# EAGLE schematic royer_1kw (EAGLE 7.6.0)
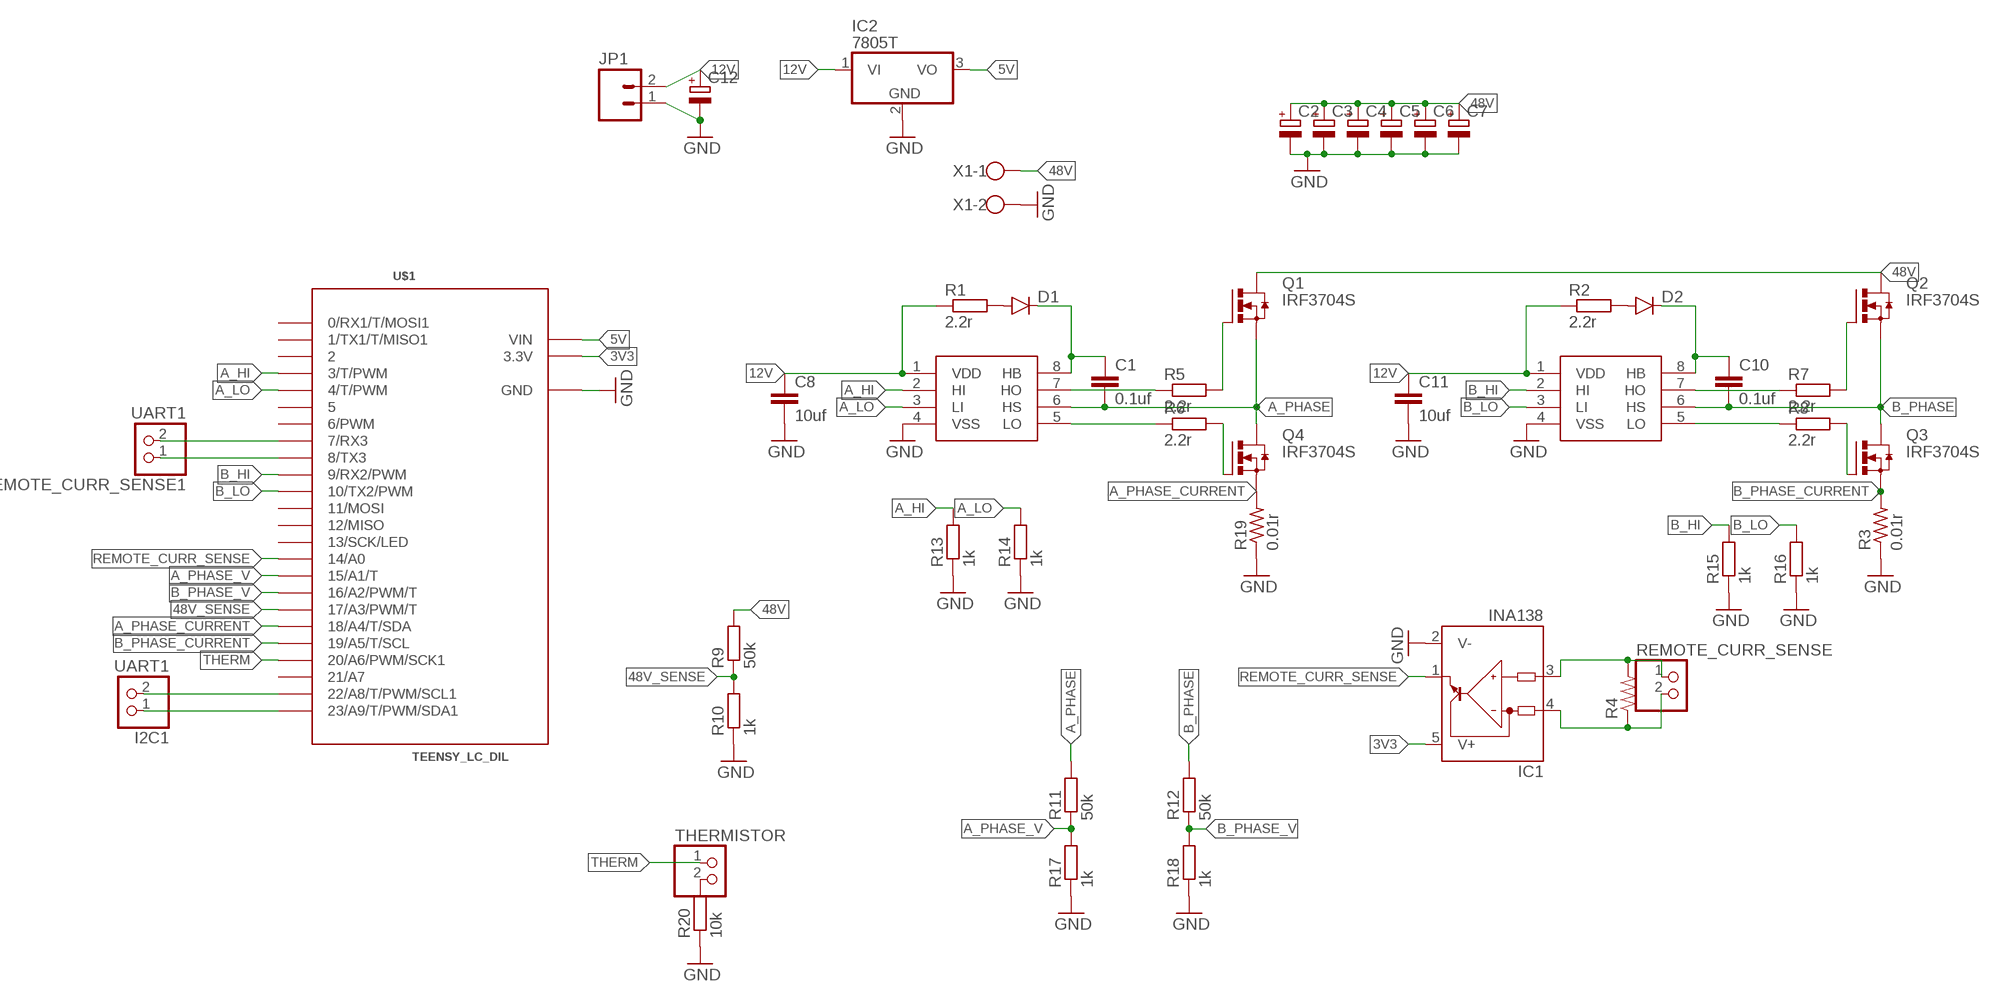
[diagram p0: schematic, sheet 1]

## Parts
C1  0.1uf  C-EUC0603  [C0603]
C2  CPOL-EUE7.5-16  [E7,5-16]
C3  CPOL-EUE7.5-16  [E7,5-16]
C4  CPOL-EUE7.5-16  [E7,5-16]
C5  CPOL-EUE7.5-16  [E7,5-16]
C6  CPOL-EUE7.5-16  [E7,5-16]
C7  CPOL-EUE7.5-16  [E7,5-16]
C8  10uf  C-EUC0805  [C0805]
C10  0.1uf  C-EUC0603  [C0603]
C11  10uf  C-EUC0805  [C0805]
C12  CPOL-EUE2.5-7  [E2,5-7]
D1  DIODESMA  [SMA-DIODE]
D2  DIODESMA  [SMA-DIODE]
I2C1  UART1  PINHD-1X2  [1X02]
IC1  INA138  [SOT23-5]
IC2  7805T  [TO220H]
JP1  M023.5MM  [SCREWTERMINAL-3.5MM-2]
Q1  IRF3704S  [D2PACK]
Q2  IRF3704S  [D2PACK]
Q3  IRF3704S  [D2PACK]
Q4  IRF3704S  [D2PACK]
R1  2.2r  R-EU_R1210  [R1210]
R2  2.2r  R-EU_R1210  [R1210]
R3  0.01r  R-US_R3225  [R3225]
R4  RESISTOR1206  [1206]
R5  2.2r  R-EU_R1210  [R1210]
R6  2.2r  R-EU_R1210  [R1210]
R7  2.2r  R-EU_R1210  [R1210]
R8  2.2r  R-EU_R1210  [R1210]
R9  50k  R-EU_R0603  [R0603]
R10  1k  R-EU_R0603  [R0603]
R11  50k  R-EU_R0603  [R0603]
R12  50k  R-EU_R0603  [R0603]
R13  1k  R-EU_R0603  [R0603]
R14  1k  R-EU_R0603  [R0603]
R15  1k  R-EU_R0603  [R0603]
R16  1k  R-EU_R0603  [R0603]
R17  1k  R-EU_R0603  [R0603]
R18  1k  R-EU_R0603  [R0603]
R19  0.01r  R-US_R3225  [R3225]
R20  10k  R-EU_R0603  [R0603]
REMOTE_CURR_SENSE  PINHD-1X2  [1X02]
REMOTE_CURR_SENSE1  UART1  PINHD-1X2  [1X02]
THERMISTOR  PINHD-1X2  [1X02]
U$1  TEENSY_LC_DIL  [TEENSY_3.0-3.2&LC_DIL]
U$2  LM5109  [SOIC8]
U$4  LM5109  [SOIC8]
X1  W237-102  [W237-102]

## Nets
3V3: IC1.5(V+) U$1.3.3V
5V: IC2.3(VO) U$1.VIN
12V: C8.1 C11.1 C12.+ IC2.1(VI) JP1.2 R1.1 R2.1 U$2.1(VDD) U$4.1(VDD)
48V: C2.+ C3.+ C4.+ C5.+ C6.+ C7.+ Q1.2(D) Q2.2(D) R9.2 X1.1
48V_SENSE: R9.1 R10.2 U$1.17/A3(17/A3/PWM/T)
A_HI: R13.2 U$1.3(3/T/PWM) U$2.2(HI)
A_LO: R14.2 U$1.4(4/T/PWM) U$2.3(LI)
A_PHASE: C1.2 Q1.3(S) Q4.2(D) R11.2 U$2.6(HS)
A_PHASE_CURRENT: Q4.3(S) R19.2 U$1.18/A4(18/A4/T/SDA)
A_PHASE_V: R11.1 R17.2 U$1.15/A1(15/A1/T)
B_HI: R15.2 U$1.9(9/RX2/PWM) U$4.2(HI)
B_LO: R16.2 U$1.10(10/TX2/PWM) U$4.3(LI)
B_PHASE: C10.2 Q2.3(S) Q3.2(D) R12.2 U$4.6(HS)
B_PHASE_CURRENT: Q3.3(S) R3.2 U$1.19/A5(19/A5/T/SCL)
B_PHASE_V: R12.1 R18.2 U$1.16/A2(16/A2/PWM/T)
GND: C2.- C3.- C4.- C5.- C6.- C7.- C8.2 C11.2 C12.- IC1.2(V-) IC2.2(GND) JP1.1 R3.1 R10.1 R13.1 R14.1 R15.1 R16.1 R17.1 R18.1 R19.1 R20.1 U$1.AGND(GND) U$1.GND U$2.4(VSS) U$4.4(VSS) X1.2
N$1: R7.1 U$4.7(HO)
N$2: R8.1 U$4.5(LO)
N$3: Q1.1(G) R5.2
N$4: Q4.1(G) R6.2
N$5: D1.A R1.2
N$6: C1.1 D1.C U$2.8(HB)
N$7: IC1.3(IN+) R4.2 REMOTE_CURR_SENSE.1
N$8: Q2.1(G) R7.2
N$9: Q3.1(G) R8.2
N$10: D2.A R2.2
N$11: C10.1 D2.C U$4.8(HB)
N$12: IC1.4(IN-) R4.1 REMOTE_CURR_SENSE.2
N$13: R20.2 THERMISTOR.2
N$15: R5.1 U$2.7(HO)
N$16: R6.1 U$2.5(LO)
N$17: REMOTE_CURR_SENSE1.1 U$1.8(8/TX3)
N$18: REMOTE_CURR_SENSE1.2 U$1.7(7/RX3)
N$19: I2C1.1 U$1.23/A9(23/A9/T/PWM/SDA1)
N$20: I2C1.2 U$1.22/A8(22/A8/T/PWM/SCL1)
REMOTE_CURR_SENSE: IC1.1(OUT) U$1.14/A0
THERM: THERMISTOR.1 U$1.20/A6(20/A6/PWM/SCK1)
Unconnected: U$1.0(0/RX1/T/MOSI1) U$1.1(1/TX1/T/MISO1) U$1.2 U$1.5 U$1.6(6/PWM) U$1.11(11/MOSI) U$1.12(12/MISO) U$1.13(13/SCK/LED) U$1.21/A7

## Library data of the parts
C1 C8 C10 C11 = rcl:C-EU: CAPACITOR, European symbol
C2-C7 C12 = rcl:CPOL-EU: POLARIZED CAPACITOR, European symbol
D1 D2 = SparkFun-DiscreteSemi:DIODE: Diode These are standard reverse protection diodes and small signal diodes. SMA package can handle up to about 1A. SOD-323 can handle about 200mA. What the SOD-323 package when ordering, there are some mfgs out there that are 5-pin packages.
I2C1 REMOTE_CURR_SENSE REMOTE_CURR_SENSE1 THERMISTOR = pinhead:PINHD-1X2: PIN HEADER
IC1 = burr-brown:INA138: High-Side Measurement Current Shunt Monitor; MF: TEXAS INSTRUMENTS; MPN: INA138NA/250; OC_FARNELL: 1564888; OC_NEWARK: 80K5906
IC2 = linear:78*: Positive VOLTAGE REGULATOR Source: http://cache.national.com/ds/LM/LM78L05.pdf http://www.fairchildsemi.com/ds/LM/LM7805.pdf
JP1 = SparkFun-Connectors:M02: Standard 2-pin 0.1" header. Use with - straight break away headers ( PRT-00116) - right angle break away headers (PRT-00553) - swiss pins (PRT-00743) - machine pins (PRT-00117) - female headers (PRT-00115) Molex polarized connector foot print use with: PRT-08233 with associated crimp pins and housings. 2.54_SCREWTERM for use with PRT-10571. 3.5mm Screw Terminal footprints for PRT-08084 5mm Screw Terminal footprints for use with PRT-08432; PROD_ID: CONN-08399
Q1-Q4 = transistor-power:IRF3704: SMPS MOSFET HEXFET® Power MOSFET Source: http://www.irf.com/product-info/datasheets/data/irf3704.pdf
R1 R2 R5-R18 R20 = rcl:R-EU_: RESISTOR, European symbol
R3 R19 = rcl:R-US_: RESISTOR, American symbol
R4 = SparkFun-Resistors:RESISTOR: Resistor Basic schematic elements and footprints for 0603, 1206, and PTH resistors.
U$1 = Teensy_3_and_LC_Series_Boards_v1.4:TEENSY_LC_DIL
U$2 U$4 = TheLibrary:LM5109
X1 = con-wago-500:W237-102: WAGO SCREW CLAMP; MPN: 237-102; OC_FARNELL: unknown; OC_NEWARK: 70K9898

## Net classes
0 default: width 0.508 mm